# Altium project main-board.PrjPcb
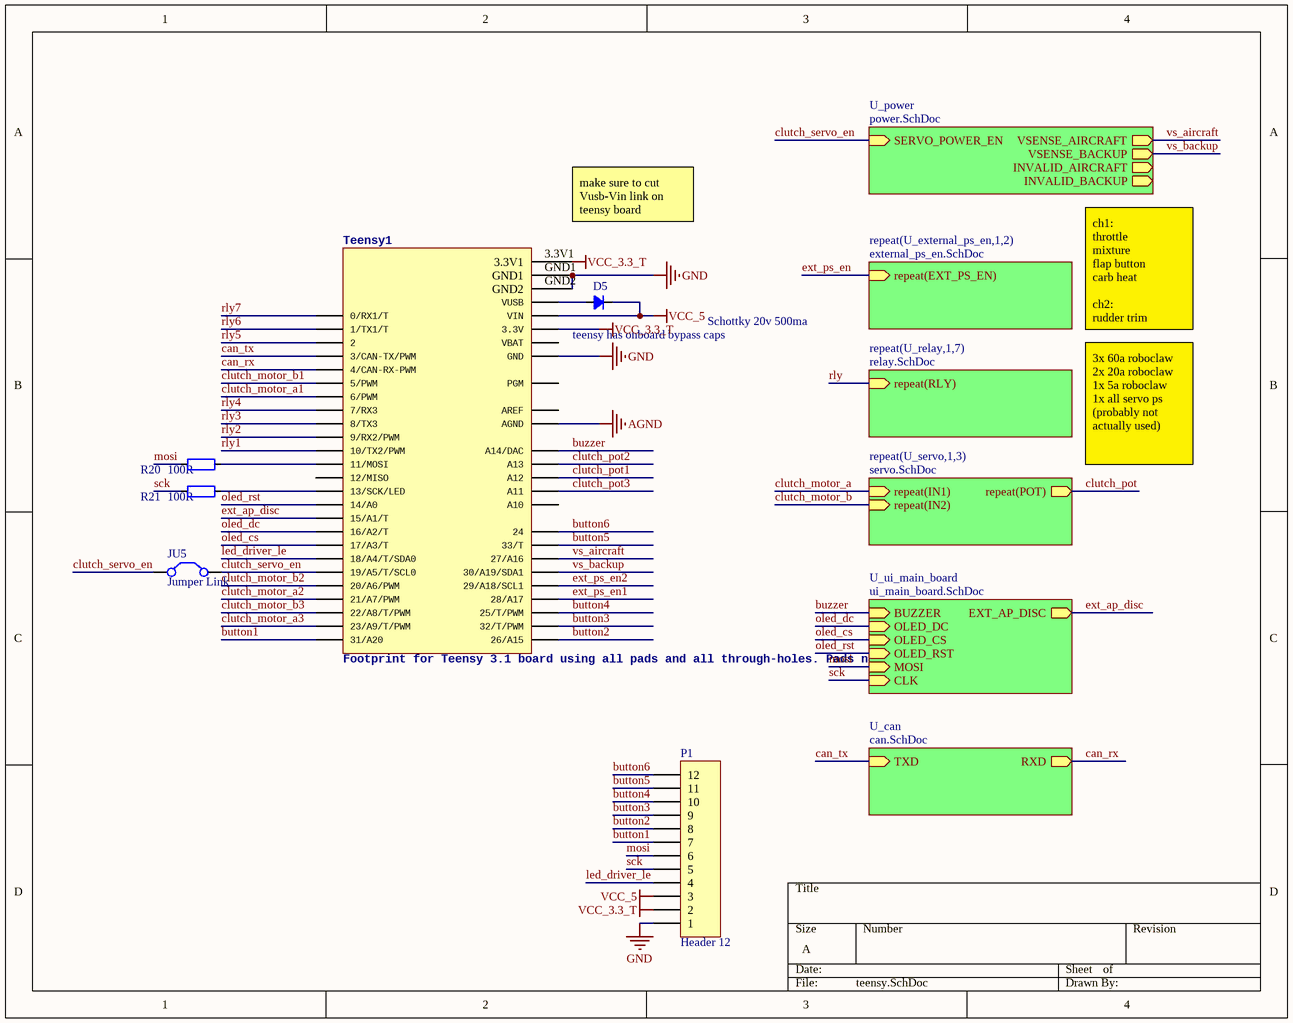
[diagram p0: teensy.SchDoc]
7 sheets, 133 parts. Net scope: hierarchical (ports join the sheet entries above them; power ports are global).
Board file: PCB1.PcbDoc
Sheets:
  teensy.SchDoc
    U_servo1 = servo.SchDoc
    U_servo2 = servo.SchDoc
    U_servo3 = servo.SchDoc
    U_relay1 = relay.SchDoc
    U_relay2 = relay.SchDoc
    U_relay3 = relay.SchDoc
    U_relay4 = relay.SchDoc
    U_relay5 = relay.SchDoc
    U_relay6 = relay.SchDoc
    U_relay7 = relay.SchDoc
    U_power = power.SchDoc
    U_external_ps_en1 = external_ps_en.SchDoc
    U_external_ps_en2 = external_ps_en.SchDoc
    U_can = can.SchDoc
    U_ui_main_board = ui_main_board.SchDoc

## Sheet teensy.SchDoc
size A

### Parts
D5  value Schottky 20v 500ma  [SOD123F]  (hidden comment: Diode_SOD523)
JU5  Jumper Link  [jumper_62.4_9]
P1  Header 12  [HDR1X12]
R20  value 100R  [RES_0603]  (hidden comment: Res_0603)
R21  value 100R  [RES_0603]  (hidden comment: Res_0603)
Teensy1  Footprint for Teensy 3.1 board using all pads and all through-holes. Pads need a 2x7 0.1" SMD header.  [TEENSY_3.1_ALLPINS]

### Sub-sheets
repeat(U_external_ps_en,1,2) = external_ps_en.SchDoc: repeat(EXT_PS_EN) (in)
repeat(U_relay,1,7) = relay.SchDoc: repeat(RLY) (in)
repeat(U_servo,1,3) = servo.SchDoc: repeat(IN1) (in), repeat(IN2) (in), repeat(POT) (out)
U_can = can.SchDoc: TXD (in), RXD (out)
U_power = power.SchDoc: SERVO_POWER_EN (in), VSENSE_AIRCRAFT (out), VSENSE_BACKUP (out), INVALID_AIRCRAFT (out), INVALID_BACKUP (out)
U_ui_main_board = ui_main_board.SchDoc: EXT_AP_DISC (out), BUZZER (in), OLED_DC (in), OLED_CS (in), OLED_RST (in), MOSI (in), CLK (in)

### Nets
AGND: Teensy1.AGND
GND: P1.1 Teensy1.GND Teensy1.GND1 Teensy1.GND2
VCC_3.3_T: P1.2 Teensy1.3.3V Teensy1.3.3V1
VCC_5: D5.2(K) P1.3 Teensy1.VIN
button1: P1.7 Teensy1.31(31/A20)
button2: P1.8 Teensy1.26(26/A15)
button3: P1.9 Teensy1.32(32/T/PWM)
button4: P1.10 Teensy1.25(25/T/PWM)
button5: P1.11 Teensy1.33(33/T)
button6: P1.12 Teensy1.24
buzzer: Teensy1.A14(A14/DAC) ; sheet U_ui_main_board/BUZZER
can_rx: Teensy1.4(4/CAN-RX-PWM) ; sheet U_can/RXD
can_tx: Teensy1.3(3/CAN-TX/PWM) ; sheet U_can/TXD
clutch_motor_a: sheet repeat(U_servo,1,3)/repeat(IN1)
clutch_motor_a1: Teensy1.6(6/PWM)
clutch_motor_a2: Teensy1.21/A7(21/A7/PWM)
clutch_motor_a3: Teensy1.23/A9(23/A9/T/PWM)
clutch_motor_b: sheet repeat(U_servo,1,3)/repeat(IN2)
clutch_motor_b1: Teensy1.5(5/PWM)
clutch_motor_b2: Teensy1.20/A6(20/A6/PWM)
clutch_motor_b3: Teensy1.22/A8(22/A8/T/PWM)
clutch_pot: sheet repeat(U_servo,1,3)/repeat(POT)
clutch_pot1: Teensy1.A12
clutch_pot2: Teensy1.A13
clutch_pot3: Teensy1.A11
clutch_servo_en: JU5.1(C1) JU5.2(C2) Teensy1.19/A5(19/A5/T/SCL0) ; sheet U_power/SERVO_POWER_EN
ext_ap_disc: Teensy1.15/A1(15/A1/T) ; sheet U_ui_main_board/EXT_AP_DISC
ext_ps_en: sheet repeat(U_external_ps_en,1,2)/repeat(EXT_PS_EN)
ext_ps_en1: Teensy1.28(28/A17)
ext_ps_en2: Teensy1.29(29/A18/SCL1)
led_driver_le: P1.4 Teensy1.18/A4(18/A4/T/SDA0)
mosi: P1.6 R20.1 ; sheet U_ui_main_board/MOSI
oled_cs: Teensy1.17/A3(17/A3/T) ; sheet U_ui_main_board/OLED_CS
oled_dc: Teensy1.16/A2(16/A2/T) ; sheet U_ui_main_board/OLED_DC
oled_rst: Teensy1.14/A0 ; sheet U_ui_main_board/OLED_RST
rly: sheet repeat(U_relay,1,7)/repeat(RLY)
rly1: Teensy1.10(10/TX2/PWM)
rly2: Teensy1.9(9/RX2/PWM)
rly3: Teensy1.8(8/TX3)
rly4: Teensy1.7(7/RX3)
rly5: Teensy1.2
rly6: Teensy1.1(1/TX1/T)
rly7: Teensy1.0(0/RX1/T)
sck: P1.5 R21.1 ; sheet U_ui_main_board/CLK
vs_aircraft: Teensy1.27(27/A16) ; sheet U_power/VSENSE_AIRCRAFT
vs_backup: Teensy1.30(30/A19/SDA1) ; sheet U_power/VSENSE_BACKUP
NetD5_1: D5.1(A) Teensy1.VUSB
NetR20_2: R20.2 Teensy1.11(11/MOSI)
NetR21_2: R21.2 Teensy1.13(13/SCK/LED)

Not connected (* = marked no-connect by the designer): Teensy1 12(12/MISO) A10 AREF PGM VBAT

### Notes on the sheet
- make sure to cut Vusb-Vin link on teensy board
- teensy has onboard bypass caps
- ch1:
  throttle
  mixture
  flap button
  carb heat
  ch2:
  rudder trim
- 3x 60a roboclaw
  2x 20a roboclaw
  1x 5a roboclaw
  1x all servo ps (probably not actually used)

### Library data of the parts
D5 = Diode_SOD523: Diode; url: http://www.digikey.com/product-detail/en/nxp-usa-inc/PMEG2010AEB,115/568-6502-1-ND/2531789
JU5 = Jumper: Jumper Wire; Published: 24-Mar-1999; LatestRevisionDate: 17-Jul-2002; LatestRevisionNote: Re-released for DXP Platform.; PackageReference: RAD-0.2; Publisher: Altium Limited; PackageDescription: Radial Cap, Thru-Hole; 2 Leads; 0.2 in Pin Spacing; ClassName: no-clearance-check
P1 = Header 12: Header, 12-Pin; LatestRevisionDate: 17-Jul-2002; LatestRevisionNote: Re-released for DXP Platform.; Publisher: Altium Limited
R20 R21 = Res_0603: Resistor
Teensy1 = TEENSY_3.1_ALL_PINS_AND_PADS

## Sheet servo.SchDoc
size A
Used 3 times, as channels U_servo1, U_servo2, U_servo3. Parts and nets are listed once, with the designators drawn on the sheet.
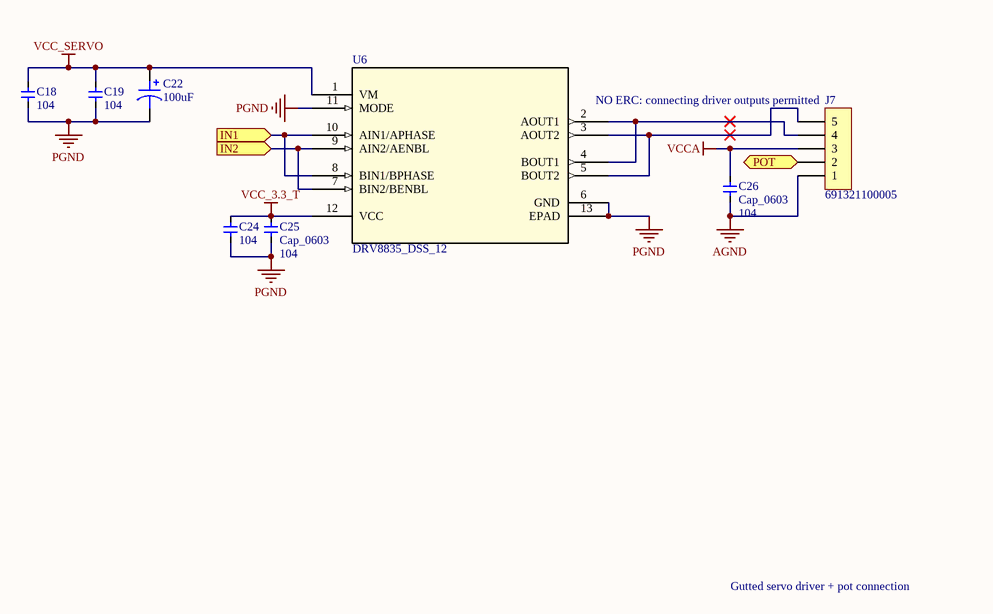
[diagram p1: servo.SchDoc]

### Parts
C18  value 104  [CAP_0603]  (hidden comment: Cap_0603)
C19  value 104  [CAP_0603]  (hidden comment: Cap_0603)
C22  100uF  [CAP ALUM 6.6MM]
C24  value 104  [CAP_0603]  (hidden comment: Cap_0603)
C25  Cap_0603  value 104  [CAP_0603]
C26  Cap_0603  value 104  [CAP_0603]
J7  691321100005  [691322110005]
U6  DRV8835_DSS_12  [DSS12_P9X2]

### Ports
IN1 (in), IN2 (in), POT (out)

### Nets
AGND: C26.2 J7.1
PGND: C18.1 C19.1 C22.2 C24.1 C25.2 U6.6(GND) U6.11(MODE) U6.13(EPAD)
VCC_3.3_T: C24.2 C25.1 U6.12(VCC)
VCC_SERVO: C18.2 C19.2 C22.1 U6.1(VM)
VCCA: C26.1 J7.3
IN1: U6.8(BIN1/BPHASE) U6.10(AIN1/APHASE) ; port IN1
IN2: U6.7(BIN2/BENBL) U6.9(AIN2/AENBL) ; port IN2
POT: J7.2 ; port POT
NetJ7_4: J7.4 U6.2(AOUT1) U6.4(BOUT1)
NetJ7_5: J7.5 U6.3(AOUT2) U6.5(BOUT2)

### Channels
U_servo1: designators end in _U_servo1; ports IN1=clutch_motor_a1 IN2=clutch_motor_b1 POT=clutch_pot1
U_servo2: designators end in _U_servo2; ports IN1=clutch_motor_a2 IN2=clutch_motor_b2 POT=clutch_pot2
U_servo3: designators end in _U_servo3; ports IN1=clutch_motor_a3 IN2=clutch_motor_b3 POT=clutch_pot3

### Notes on the sheet
- (near J7) NO ERC: connecting driver outputs permitted
- Gutted servo driver + pot connection

### Library data of the parts
C18 C19 C24-C26 = Cap_0603: Capacitor
C22 = Polarised Capacitor: PCE4180CT-ND; Value: 100uF
J7 = 691321100005: WR-TBL Terminal block - serie 3211 - 3.50 mm; Manufacturer: Würth Elektronik eiSos GmbH; ComponentLink1 Description: Manufacturer; ComponentLink2 Description: Datasheet; NoPins: 5; Created Date: 9 December 2013; partNo: 691321100005; ComponentLink1URL: http://www.we-online.com; ComponentLink2URL: http://katalog.we-online.de/em/datasheet/6913211000xx.pdf; Created by: Karrer Zheng
U6 = DRV8835_DSS_12: Imported; Vendor: Texas Instruments; Manufacturer_Part_Number: drv8835_dss_12; Value: Value; Type: Type; RefDes: RefDes

## Sheet relay.SchDoc
size A
Used 7 times, as channels U_relay1, U_relay2, U_relay3, U_relay4, U_relay5, U_relay6, U_relay7. Parts and nets are listed once, with the designators drawn on the sheet.
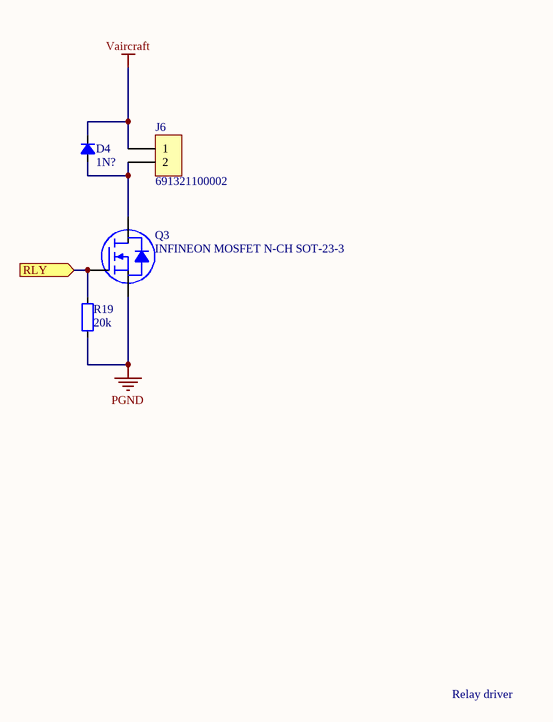
[diagram p2: relay.SchDoc]

### Parts
D4  value 1N?  [SOD123F]  (hidden comment: Diode_SOD523)
J6  691321100002  [691322110002]
Q3  INFINEON MOSFET N-CH SOT-23-3  [INFINEON SOT-23-3]
R19  value 20k  [RES_0603]  (hidden comment: Res_0603)

### Ports
RLY (in)

### Nets
PGND: Q3.3(S) R19.1
Vaircraft: D4.2(K) J6.1
RLY: Q3.1(G) R19.2 ; port RLY
NetD4_1: D4.1(A) J6.2 Q3.2(D)

### Channels
U_relay1: designators end in _U_relay1; ports RLY=rly1
U_relay2: designators end in _U_relay2; ports RLY=rly2
U_relay3: designators end in _U_relay3; ports RLY=rly3
U_relay4: designators end in _U_relay4; ports RLY=rly4
U_relay5: designators end in _U_relay5; ports RLY=rly5
U_relay6: designators end in _U_relay6; ports RLY=rly6
U_relay7: designators end in _U_relay7; ports RLY=rly7

### Notes on the sheet
- Relay driver

### Library data of the parts
D4 = Diode_SOD523: Diode
J6 = 691321100002: WR-TBL Terminal block - serie 3211 - 3.50 mm; Manufacturer: Würth Elektronik eiSos GmbH; ComponentLink1 Description: Manufacturer; ComponentLink2 Description: Datasheet; NoPins: 2; Created Date: 9 December 2013; partNo: 691321100002; ComponentLink1URL: http://www.we-online.com; ComponentLink2URL: http://katalog.we-online.de/em/datasheet/6913211000xx.pdf; Created by: Karrer Zheng
R19 = Res_0603: Resistor

## Sheet power.SchDoc
size A
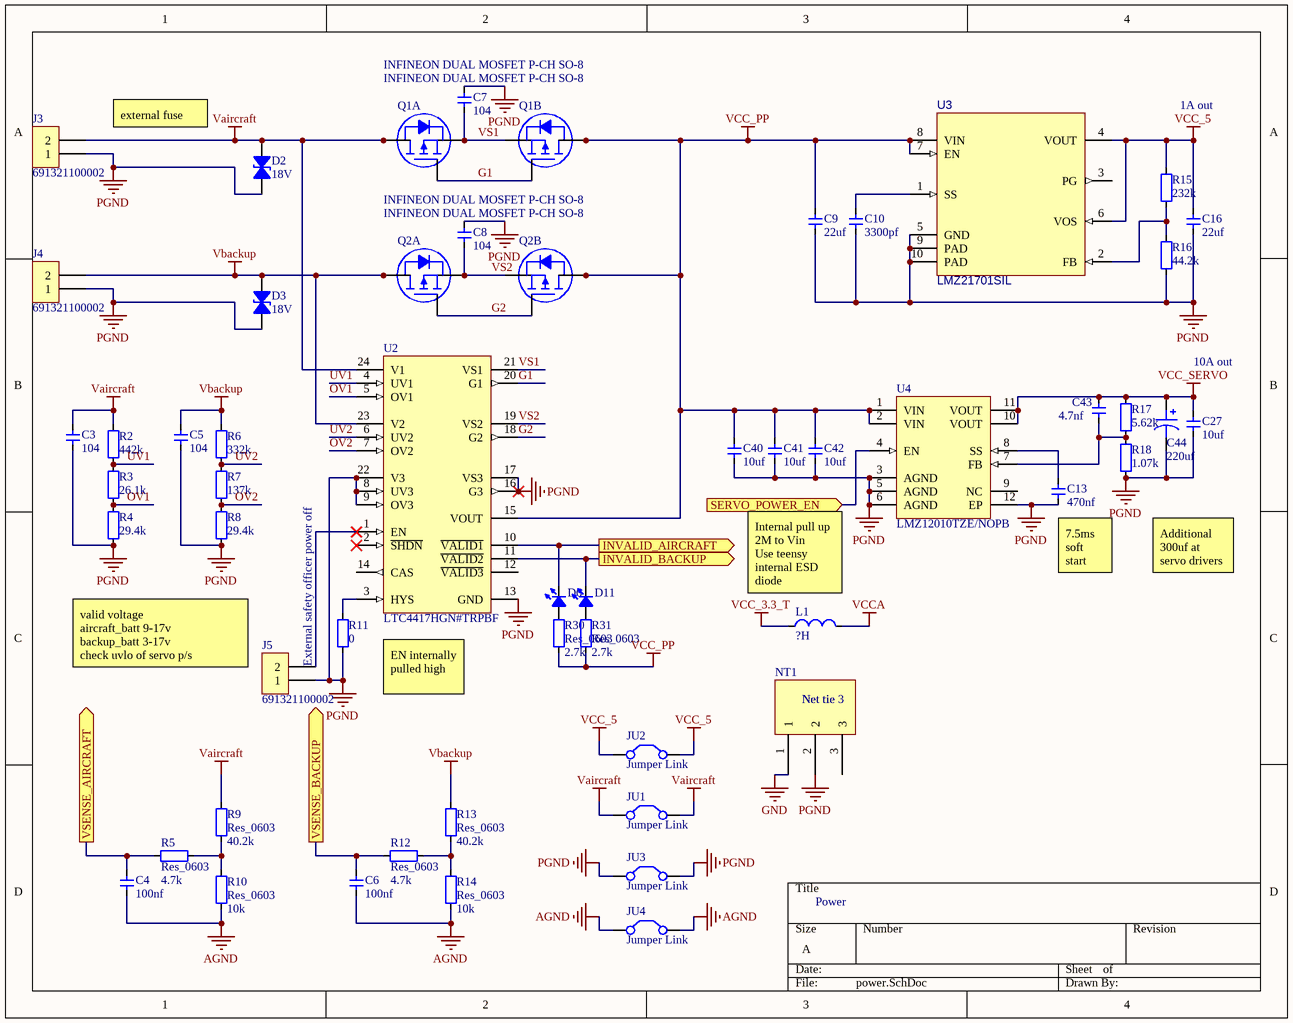
[diagram p3: power.SchDoc]

### Parts
C3  value 104  [CAP_0603]  (hidden comment: Cap_0603)
C4  value 100nf  [CAP_0603]  (hidden comment: Cap_0603)
C5  value 104  [CAP_0603]  (hidden comment: Cap_0603)
C6  value 100nf  [CAP_0603]  (hidden comment: Cap_0603)
C7  value 104  [CAP_0603]  (hidden comment: Cap_0603)
C8  value 104  [CAP_0603]  (hidden comment: Cap_0603)
C9  value 22uf  [CAP_0805]  (hidden comment: Cap_0805)
C10  value 3300pf  [CAP_0603]  (hidden comment: Cap_0603)
C13  value 470nf  [CAP_0603]  (hidden comment: Cap_0603)
C16  value 22uf  [CAP_0805]  (hidden comment: Cap_0805)
C27  value 10uf  [CAP_0805]  (hidden comment: Cap_0805)
C40  value 10uf  [CAP_0805]  (hidden comment: Cap_0805)
C41  value 10uf  [CAP_0805]  (hidden comment: Cap_0805)
C42  value 10uf  [CAP_0805]  (hidden comment: Cap_0805)
C43  value 4.7nf  [CAP_0603]  (hidden comment: Cap_0603)
C44  220uf  [CAP ALUM 8.3MM]
D2  18V  [SOD123F]
D3  18V  [SOD123F]
D6  LED_0603  [LED_0603_GREEN]  (value not drawn)
D11  LED_0603  [LED_0603_GREEN]  (value not drawn)
J3  691321100002  [691322110002]
J4  691321100002  [691322110002]
J5  691321100002  [62000211121]
JU1  Jumper Link  [jumper_56.5]
JU2  Jumper Link  [jumper_43.5]
JU3  Jumper Link  [jumper_12]
JU4  Jumper Link  [jumper_52]
L1  value ?H  [IND_0603]  (hidden comment: Ind_0603)
NT1  Net tie 3  [Net tie 3]  (net tie, no BOM)
Q1  INFINEON DUAL MOSFET P-CH SO-8  [INFINEON SO-8]  (parts A,B of 2)
Q2  INFINEON DUAL MOSFET P-CH SO-8  [INFINEON SO-8]  (parts A,B of 2)
R2  value 442k  [RES_0603]  (hidden comment: Res_0603)
R3  value 26.1k  [RES_0603]  (hidden comment: Res_0603)
R4  value 29.4k  [RES_0603]  (hidden comment: Res_0603)
R5  Res_0603  value 4.7k  [RES_0603]
R6  value 332k  [RES_0603]  (hidden comment: Res_0603)
R7  value 137k  [RES_0603]  (hidden comment: Res_0603)
R8  value 29.4k  [RES_0603]  (hidden comment: Res_0603)
R9  Res_0603  value 40.2k  [RES_0603]
R10  Res_0603  value 10k  [RES_0603]
R11  value 0  [RES_0603]  (hidden comment: Res_0603)
R12  Res_0603  value 4.7k  [RES_0603]
R13  Res_0603  value 40.2k  [RES_0603]
R14  Res_0603  value 10k  [RES_0603]
R15  value 232k  [RES_0603]  (hidden comment: Res_0603)
R16  value 44.2k  [RES_0603]  (hidden comment: Res_0603)
R17  value 5.62k  [RES_0603]  (hidden comment: Res_0603)
R18  value 1.07k  [RES_0603]  (hidden comment: Res_0603)
R30  Res_0603  value 2.7k  [RES_0603]
R31  Res_0603  value 2.7k  [RES_0603]
U2  LTC4417HGN#TRPBF  [LT-GN-24_N]
U3  LMZ21701SIL  [LMZ21701SIL]
U4  LMZ12010TZE/NOPB  [TZA11A_V]

### Ports
INVALID_AIRCRAFT (out), INVALID_BACKUP (out), SERVO_POWER_EN (in), VSENSE_AIRCRAFT (out), VSENSE_BACKUP (out)

### Nets
AGND: C4.1 C6.1 JU4.1(C1) JU4.2(C2) R10.1 R14.1
GND: NT1.1
PGND: C3.1 C5.1 C7.2 C8.2 C9.1 C10.1 C13.1 C16.1 C27.1 C40.1 C41.1 C42.1 C44.2 D2.1 D3.1 J3.1 J4.1 J5.1 JU3.1(C1) JU3.2(C2) NT1.2 R4.1 R8.1 R11.1 R16.1 R18.1 U2.8(UV3) U2.9(OV3) U2.13(GND) U2.16(G3) U2.17(VS3) U2.22(V3) U3.5(GND) U3.9(PAD) U3.10(PAD) U4.3(AGND) U4.5(AGND) U4.6(AGND) U4.12(EP)
Vaircraft: C3.2 D2.2 J3.2 JU1.1(C1) JU1.2(C2) Q1.7(D1) Q1.8(D1) R2.2 R9.2 U2.24(V1)
Vbackup: C5.2 D3.2 J4.2 Q2.7(D1) Q2.8(D1) R6.2 R13.2 U2.23(V2)
VCC_3.3_T: L1.1
VCC_5: C16.2 JU2.1(C1) JU2.2(C2) R15.2 U3.4(VOUT) U3.6(VOS)
VCC_PP: C9.2 C40.2 C41.2 C42.2 Q1.5(D2) Q1.6(D2) Q2.5(D2) Q2.6(D2) R30.1 R31.1 U2.15(VOUT) U3.7(EN) U3.8(VIN) U4.1(VIN) U4.2(VIN)
VCC_SERVO: C27.2 C43.2 C44.1 R17.2 U4.10(VOUT) U4.11(VOUT)
VCCA: L1.2
clutch_servo_en: U4.4(EN) ; port SERVO_POWER_EN
G1: Q1.2(G1) Q1.4(G2) U2.20(G1)
G2: Q2.2(G1) Q2.4(G2) U2.18(G2)
OV1: R3.1 R4.2 U2.5(OV1)
OV2: R7.1 R8.2 U2.7(OV2)
UV1: R2.1 R3.2 U2.4(UV1)
UV2: R6.1 R7.2 U2.6(UV2)
VS1: C7.1 Q1.1(S1) Q1.3(S2) U2.21(VS1)
VS2: C8.1 Q2.1(S1) Q2.3(S2) U2.19(VS2)
vs_aircraft: C4.2 R5.1 ; port VSENSE_AIRCRAFT
vs_backup: C6.2 R12.1 ; port VSENSE_BACKUP
NetC10_2: C10.2 U3.1(SS)
NetC13_2: C13.2 U4.8(SS)
NetC43_1: C43.1 R17.1 R18.2 U4.7(FB)
NetD6_1: D6.1(A) R30.2
NetD6_2: D6.2(K) U2.10(~{VALID1}) ; port INVALID_AIRCRAFT
NetD11_1: D11.1(A) R31.2
NetD11_2: D11.2(K) U2.11(~{VALID2}) ; port INVALID_BACKUP
NetJ5_2: J5.2 U2.1(EN)
NetR5_2: R5.2 R9.1 R10.2
NetR11_2: R11.2 U2.3(HYS)
NetR12_2: R12.2 R13.1 R14.2
NetR15_1: R15.1 R16.2 U3.2(FB)

Not connected (* = marked no-connect by the designer): NT1 3; U2 2(~{SHDN})* 12(~{VALID3}) 14(CAS); U3 3(PG); U4 9(NC)

### Notes on the sheet
- external fuse
- 1A out
- 10A out
- (near C13) 7.5ms soft start
- Additional 300uf at servo drivers
- Internal pull up 2M to Vin
  Use teensy internal ESD diode
- valid voltage
  aircraft_batt 9-17v
  backup_batt 3-17v
  check uvlo of servo p/s
- (near J5) External safety officer power off
- EN internally pulled high
- Power

### Library data of the parts
C3-C8 C10 C13 C43 = Cap_0603: Capacitor
C9 C16 C27 C40-C42 = Cap_0805: Capacitor
C44 = Polarised Capacitor: EEE-HA1V221UP; Value: 220uf
D2 D3 = Diode Zener Bidirectional: Bidirectional Zener Diode
D6 D11 = LED_0603: LED
J3-J5 = 691321100002: as J6 on sheet relay; Created Date: 9 December 2013; partNo: 691321100002; ComponentLink1URL: http://www.we-online.com; ComponentLink2URL: http://katalog.we-online.de/em/datasheet/6913211000xx.pdf; Created by: Karrer Zheng
JU1-JU4 = Jumper: Jumper Wire; Published: 24-Mar-1999; LatestRevisionDate: 17-Jul-2002; LatestRevisionNote: Re-released for DXP Platform.; PackageReference: RAD-0.2; Publisher: Altium Limited; PackageDescription: Radial Cap, Thru-Hole; 2 Leads; 0.2 in Pin Spacing; ClassName: no-clearance-check
L1 = Ind_0603: Inductor
NT1 = Net tie
R2-R18 R30 R31 = Res_0603: Resistor
U2 = LTC4417HGN#TRPBF: Prioritized PowerPath Controller, 2.5 to 36 V Vin, 24-pin SOP (GN-24), -40 to 125 degC, Pb-Free, Tape and Reel; Manufacturer: Linear Technology; Ideal Diode: Triple, External, P-Channel; PackageVersion: Rev. B, 03/2012; PackageReference: GN24; PackageDescription: 24-Pin Plastic SSOP , Body 8.5 x 3.9 mm, Pitch 0.635 mm; Supplier 1: Digi-Key; Supplier Part Number 1: LTC4417HGN#TRPBF-ND; Supplier 2: Newark; Supplier Part Number 2: 53W0557; Packing: Tape and Reel; RoHS: TRUE; Mounting Technology: Surface Mount; PartNumber: LTC4417HGN#TRPBF; ComponentLink1Description: Manufacturer URL; ComponentLink1URL: http://www.linear.com/; ComponentLink2Description: Datasheet; ComponentLink2URL: http://cds.linear.com/docs/en/datasheet/4417f.pdf; ComponentLink3Description: Package Specification; ComponentLink3URL: http://cds.linear.com/docs/en/packaging/05081641_B_GN24.pdf
U3 = LMZ21701SIL: 1A SIMPLE SWITCHER Nano Module with 17V Maximum Input Voltage, SIL0008E; Alternate Manufacturer: None; Manufacturer: Texas Instruments; SymbolCreator: a0411947; CompType: IC; U/M: EA; SymbolVersion: 2013-08-23; PartNumber: LMZ21701SIL; PackageReference: SIL0008E; MountType: SMT; ComponentLink1Description: Datasheet Link; ComponentLink1URL: https://sps06.itg.ti.com/sites/KMS/crossdivteams/altium/docs/ComponentDatasheets/LMZ21701_DS_2013_07_10.pdf; RoHS: Y; Publisher: Texas Instruments; LatestRevisionDate: 2014-08-23
U4 = LMZ12010TZE/NOPB: 10A, SIMPLE SWITCHER® Power Module with 20V Maximum Input, 11 pin TO-PMOD, 250 Reel; Manufacturer: National Semiconductor; PackageTopMarking: NSUZXYTTE#*LMZ12010; PowerWise: N; High-Reliability: Y; DatasheetVersion: Apr-2011; PackageVersion: revE, Apr-2011; PackageReference: TZA11A; PackageDescription: TO-PMOD, 15 x 15 x 5.9 mm Body, 11 Lead, 1.27 mm Pitch, Surface Mount; PartNumber: LMZ12010TZE/NOPB; RoHS: Y; PinCount: 11; CompType: Switcher; ComponentLink1Description: Manufacturer URL; ComponentLink1URL: http://www.national.com/; ComponentLink2Description: LMZ12010 Datasheet; ComponentLink2URL: http://www.national.com/ds/LM/LMZ12010.pdf; ComponentLink3Description: LMZ12010 Web Page; ComponentLink3URL: http://www.national.com/pf/LM/LMZ12010.html; ComponentLink4Description: TZA11A Package Page; ComponentLink4URL: http://www.national.com/packaging/folders/tza11a.html

## Sheet external_ps_en.SchDoc
size A
Used 2 times, as channels U_external_ps_en1, U_external_ps_en2. Parts and nets are listed once, with the designators drawn on the sheet.
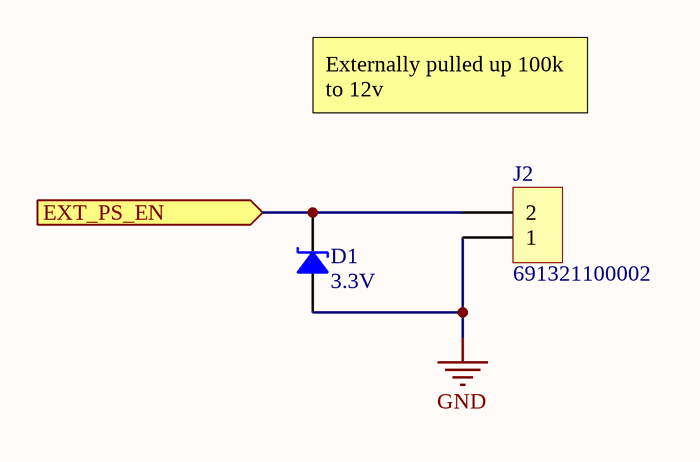
[diagram p4: external_ps_en.SchDoc]

### Parts
D1  3.3V  [SOD123F]
J2  691321100002  [691322110002]

### Ports
EXT_PS_EN (in)

### Nets
GND: D1.1 J2.1
EXT_PS_EN: D1.2 J2.2 ; port EXT_PS_EN

### Channels
U_external_ps_en1: designators end in _U_external_ps_en1; ports EXT_PS_EN=ext_ps_en1
U_external_ps_en2: designators end in _U_external_ps_en2; ports EXT_PS_EN=ext_ps_en2

### Notes on the sheet
- Externally pulled up 100k to 12v

### Library data of the parts
D1 = Diode Zener: Zener Diode
J2 = 691321100002: as J6 on sheet relay; Created Date: 9 December 2013; partNo: 691321100002; ComponentLink1URL: http://www.we-online.com; ComponentLink2URL: http://katalog.we-online.de/em/datasheet/6913211000xx.pdf; Created by: Karrer Zheng

## Sheet can.SchDoc
size A
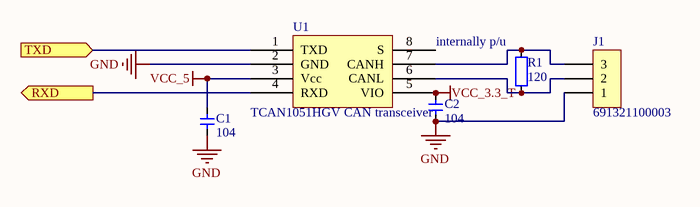
[diagram p5: can.SchDoc]

### Parts
C1  value 104  [CAP_0603]  (hidden comment: Cap_0603)
C2  value 104  [CAP_0603]  (hidden comment: Cap_0603)
J1  691321100003  [691322110003]
R1  value 120  [RES_0603]  (hidden comment: Res_0603)
U1  TCAN1051HGV CAN transceiver  [SOIC127P600X175-8N]

### Ports
RXD (out), TXD (in)

### Nets
GND: C1.1 C2.1 J1.1 U1.2(GND)
VCC_3.3_T: C2.2 U1.5(VIO)
VCC_5: C1.2 U1.3(Vcc)
can_rx: U1.4(RXD) ; port RXD
can_tx: U1.1(TXD) ; port TXD
NetJ1_2: J1.2 R1.1 U1.6(CANL)
NetJ1_3: J1.3 R1.2 U1.7(CANH)

Not connected (* = marked no-connect by the designer): U1 8(S)

### Notes on the sheet
- (near R1) internally p/u

### Library data of the parts
C1 C2 = Cap_0603: Capacitor
J1 = 691321100003: WR-TBL Terminal block - serie 3211 - 3.50 mm; Manufacturer: Würth Elektronik eiSos GmbH; ComponentLink1 Description: Manufacturer; ComponentLink2 Description: Datasheet; NoPins: 3; Created Date: 9 December 2013; partNo: 691321100003; ComponentLink1URL: http://www.we-online.com; ComponentLink2URL: http://katalog.we-online.de/em/datasheet/6913211000xx.pdf; Created by: Karrer Zheng
R1 = Res_0603: Resistor
U1 = TCAN1051HGV

## Sheet ui_main_board.SchDoc
size A
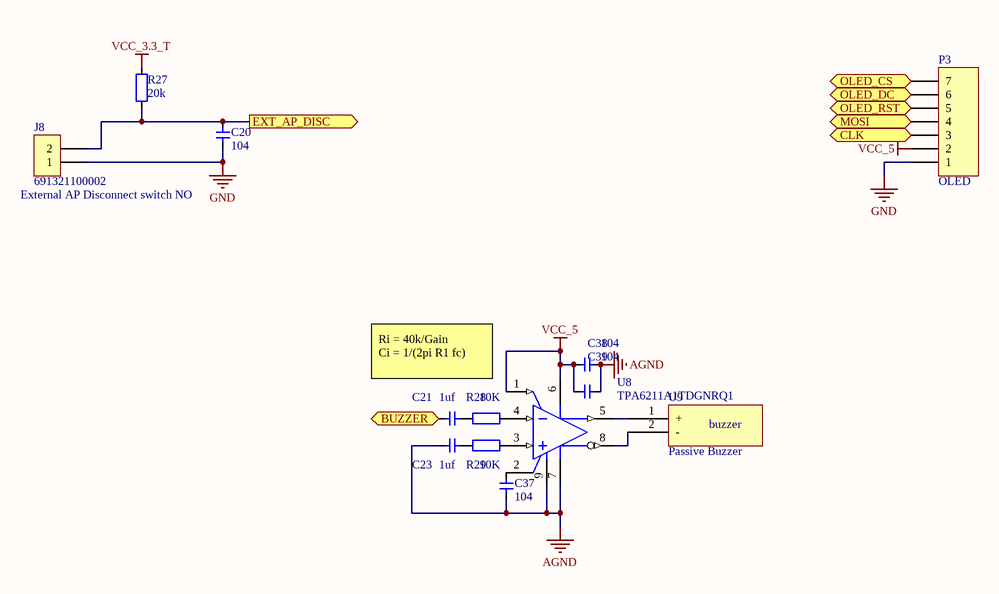
[diagram p6: ui_main_board.SchDoc]

### Parts
C20  value 104  [CAP_0603]  (hidden comment: Cap_0603)
C21  value 1uf  [CAP_0603]  (hidden comment: Cap_0603)
C23  value 1uf  [CAP_0603]  (hidden comment: Cap_0603)
C37  value 104  [CAP_0603]  (hidden comment: Cap_0603)
C38  value 104  [CAP_0603]  (hidden comment: Cap_0603)
C39  value 104  [CAP_0603]  (hidden comment: Cap_0603)
J8  691321100002  [691322110002]
P3  OLED  [HDR1X7]
R27  value 20k  [RES_0603]  (hidden comment: Res_0603)
R28  value 10K  [RES_0603]  (hidden comment: Res_0603)
R29  value 10K  [RES_0603]  (hidden comment: Res_0603)
U8  TPA6211A1TDGNRQ1  [TI-DGN8-1760X1425TP_N]
U9  Passive Buzzer  [62000211121]

### Ports
BUZZER (in), CLK (in), EXT_AP_DISC (out), MOSI (in), OLED_CS (in), OLED_DC (in), OLED_RST (in)

### Nets
AGND: C23.1 C37.2 C38.2 C39.2 U8.7(GND) U8.9(EP)
GND: C20.1 J8.1 P3.1
VCC_3.3_T: R27.2
VCC_5: C38.1 C39.1 P3.2 U8.1(~{SHUTDOWN}) U8.6(VDD)
buzzer: C21.1 ; port BUZZER
ext_ap_disc: C20.2 J8.2 R27.1 ; port EXT_AP_DISC
mosi: P3.4 ; port MOSI
oled_cs: P3.7 ; port OLED_CS
oled_dc: P3.6 ; port OLED_DC
oled_rst: P3.5 ; port OLED_RST
sck: P3.3 ; port CLK
NetC21_2: C21.2 R28.1
NetC23_2: C23.2 R29.1
NetC37_1: C37.1 U8.2(BYPASS)
NetR28_2: R28.2 U8.4(IN-)
NetR29_2: R29.2 U8.3(IN+)
NetU8_5: U8.5(VO+) U9.1(+)
NetU8_8: U8.8(VO-) U9.2(-)

### Notes on the sheet
- (near J8) External AP Disconnect switch NO
- Ri = 40k/Gain
  Ci = 1/(2pi R1 fc)
- (in symbol Passive Buzzer) buzzer

### Library data of the parts
C20 C21 C23 C37-C39 = Cap_0603: Capacitor
J8 = 691321100002: as J6 on sheet relay; Created Date: 9 December 2013; partNo: 691321100002; ComponentLink1URL: http://www.we-online.com; ComponentLink2URL: http://katalog.we-online.de/em/datasheet/6913211000xx.pdf; Created by: Karrer Zheng
P3 = Header 7: Header, 7-Pin; LatestRevisionDate: 17-Jul-2002; LatestRevisionNote: Re-released for DXP Platform.; Publisher: Altium Limited
R27-R29 = Res_0603: Resistor
U8 = TPA6211A1TDGNRQ1: Automotive Catalog 3.1-W Mono, Fully Differential, Class-AB Audio Amplifier, -40 to 105 degC, 8-pin SOP (DGN8), Green (RoHS & no Sb/Br); Manufacturer: Texas Instruments; Output Power(W): 2.45; PSRR(dB): -85; SubFamily: Dynamic Speaker; Supply Max(Max)(Volt): 5.5; Supply Min(Min)(Volt): 2.5; DatasheetVersion: SBOS555; PackageVersion: 4073271/F, 05/2011; PackageReference: DGN8-1760X1425TP; PackageDescription: 8-Pin Plastic Small Outline, Body 3 x 3 mm, Pitch 0.65 mm; Supplier 1: Digi-Key; Supplier Part Number 1: 296-29059-2-ND; Supplier 2: Digi-Key; Supplier Part Number 2: 296-29059-1-ND; Supplier 3: Digi-Key; Supplier Part Number 3: 296-29059-6-ND; Supplier 4: Mouser; Supplier Part Number 4: 595-TPA6211A1TDGNRQ1; Eco-Plan: Green (RoHS & no Sb/Br); Speaker Amp Type: Class-AB; Speaker Channels: Mono; Mounting Technology: Surface Mount; Code_JEDEC: MO-187; PartNumber: TPA6211A1TDGNRQ1; ComponentLink1Description: Manufacturer URL; ComponentLink1URL: http://www.ti.com/; ComponentLink2Description: Datasheet; ComponentLink2URL: http://www.ti.com/general/docs/lit/getliterature.tsp?genericPartNumber=TPA6211A1-Q1&fileType=pdf; ComponentLink3Description: Package Specification; ComponentLink3URL: http://www.ti.com/litv/pdf/mpds046e

## Nets that join several sheets
AGND: teensy (Teensy1.AGND), U_servo1 (C26_U_servo1.2 J7_U_servo1.1), U_servo2 (C26_U_servo2.2 J7_U_servo2.1), U_servo3 (C26_U_servo3.2 J7_U_servo3.1), power (6 pins), ui_main_board (6 pins)
GND: teensy (P1.1 Teensy1.GND Teensy1.GND1 Teensy1.GND2), power (NT1.1), U_external_ps_en1 (D1_U_external_ps_en1.1 J2_U_external_ps_en1.1), U_external_ps_en2 (D1_U_external_ps_en2.1 J2_U_external_ps_en2.1), can (C1.1 C2.1 J1.1 U1.2), ui_main_board (C20.1 J8.1 P3.1)
PGND: U_servo1 (8 pins), U_servo2 (8 pins), U_servo3 (8 pins), U_relay1 (Q3_U_relay1.3 R19_U_relay1.1), U_relay2 (Q3_U_relay2.3 R19_U_relay2.1), U_relay3 (Q3_U_relay3.3 R19_U_relay3.1), U_relay4 (Q3_U_relay4.3 R19_U_relay4.1), U_relay5 (Q3_U_relay5.3 R19_U_relay5.1), U_relay6 (Q3_U_relay6.3 R19_U_relay6.1), U_relay7 (Q3_U_relay7.3 R19_U_relay7.1), power (39 pins)
Vaircraft: U_relay1 (D4_U_relay1.2 J6_U_relay1.1), U_relay2 (D4_U_relay2.2 J6_U_relay2.1), U_relay3 (D4_U_relay3.2 J6_U_relay3.1), U_relay4 (D4_U_relay4.2 J6_U_relay4.1), U_relay5 (D4_U_relay5.2 J6_U_relay5.1), U_relay6 (D4_U_relay6.2 J6_U_relay6.1), U_relay7 (D4_U_relay7.2 J6_U_relay7.1), power (10 pins)
VCC_3.3_T: teensy (P1.2 Teensy1.3.3V Teensy1.3.3V1), U_servo1 (C24_U_servo1.2 C25_U_servo1.1 U6_U_servo1.12), U_servo2 (C24_U_servo2.2 C25_U_servo2.1 U6_U_servo2.12), U_servo3 (C24_U_servo3.2 C25_U_servo3.1 U6_U_servo3.12), power (L1.1), can (C2.2 U1.5), ui_main_board (R27.2)
VCC_5: teensy (D5.2 P1.3 Teensy1.VIN), power (6 pins), can (C1.2 U1.3), ui_main_board (5 pins)
VCC_SERVO: U_servo1 (C18_U_servo1.2 C19_U_servo1.2 C22_U_servo1.1 U6_U_servo1.1), U_servo2 (C18_U_servo2.2 C19_U_servo2.2 C22_U_servo2.1 U6_U_servo2.1), U_servo3 (C18_U_servo3.2 C19_U_servo3.2 C22_U_servo3.1 U6_U_servo3.1), power (6 pins)
VCCA: U_servo1 (C26_U_servo1.1 J7_U_servo1.3), U_servo2 (C26_U_servo2.1 J7_U_servo2.3), U_servo3 (C26_U_servo3.1 J7_U_servo3.3), power (L1.2)
buzzer: teensy (Teensy1.A14), ui_main_board (C21.1)
can_rx: teensy (Teensy1.4), can (U1.4)
can_tx: teensy (Teensy1.3), can (U1.1)
clutch_motor_a1: teensy (Teensy1.6), U_servo1 (U6_U_servo1.8 U6_U_servo1.10)
clutch_motor_a2: teensy (Teensy1.21/A7), U_servo2 (U6_U_servo2.8 U6_U_servo2.10)
clutch_motor_a3: teensy (Teensy1.23/A9), U_servo3 (U6_U_servo3.8 U6_U_servo3.10)
clutch_motor_b1: teensy (Teensy1.5), U_servo1 (U6_U_servo1.7 U6_U_servo1.9)
clutch_motor_b2: teensy (Teensy1.20/A6), U_servo2 (U6_U_servo2.7 U6_U_servo2.9)
clutch_motor_b3: teensy (Teensy1.22/A8), U_servo3 (U6_U_servo3.7 U6_U_servo3.9)
clutch_pot1: teensy (Teensy1.A12), U_servo1 (J7_U_servo1.2)
clutch_pot2: teensy (Teensy1.A13), U_servo2 (J7_U_servo2.2)
clutch_pot3: teensy (Teensy1.A11), U_servo3 (J7_U_servo3.2)
clutch_servo_en: teensy (JU5.1 JU5.2 Teensy1.19/A5), power (U4.4)
ext_ap_disc: teensy (Teensy1.15/A1), ui_main_board (C20.2 J8.2 R27.1)
ext_ps_en1: teensy (Teensy1.28), U_external_ps_en1 (D1_U_external_ps_en1.2 J2_U_external_ps_en1.2)
ext_ps_en2: teensy (Teensy1.29), U_external_ps_en2 (D1_U_external_ps_en2.2 J2_U_external_ps_en2.2)
mosi: teensy (P1.6 R20.1), ui_main_board (P3.4)
oled_cs: teensy (Teensy1.17/A3), ui_main_board (P3.7)
oled_dc: teensy (Teensy1.16/A2), ui_main_board (P3.6)
oled_rst: teensy (Teensy1.14/A0), ui_main_board (P3.5)
rly1: teensy (Teensy1.10), U_relay1 (Q3_U_relay1.1 R19_U_relay1.2)
rly2: teensy (Teensy1.9), U_relay2 (Q3_U_relay2.1 R19_U_relay2.2)
rly3: teensy (Teensy1.8), U_relay3 (Q3_U_relay3.1 R19_U_relay3.2)
rly4: teensy (Teensy1.7), U_relay4 (Q3_U_relay4.1 R19_U_relay4.2)
rly5: teensy (Teensy1.2), U_relay5 (Q3_U_relay5.1 R19_U_relay5.2)
rly6: teensy (Teensy1.1), U_relay6 (Q3_U_relay6.1 R19_U_relay6.2)
rly7: teensy (Teensy1.0), U_relay7 (Q3_U_relay7.1 R19_U_relay7.2)
sck: teensy (P1.5 R21.1), ui_main_board (P3.3)
vs_aircraft: teensy (Teensy1.27), power (C4.2 R5.1)
vs_backup: teensy (Teensy1.30), power (C6.2 R12.1)